# Altium schematic sheet 04_MCU.SchDoc: =TitleParameter
size A3; Organization: ASISGUARD; Address1: Kemalpasa, Kemalpasa Cd. No:290 D:292H, 35060 Bornova/Izmir/Turkey
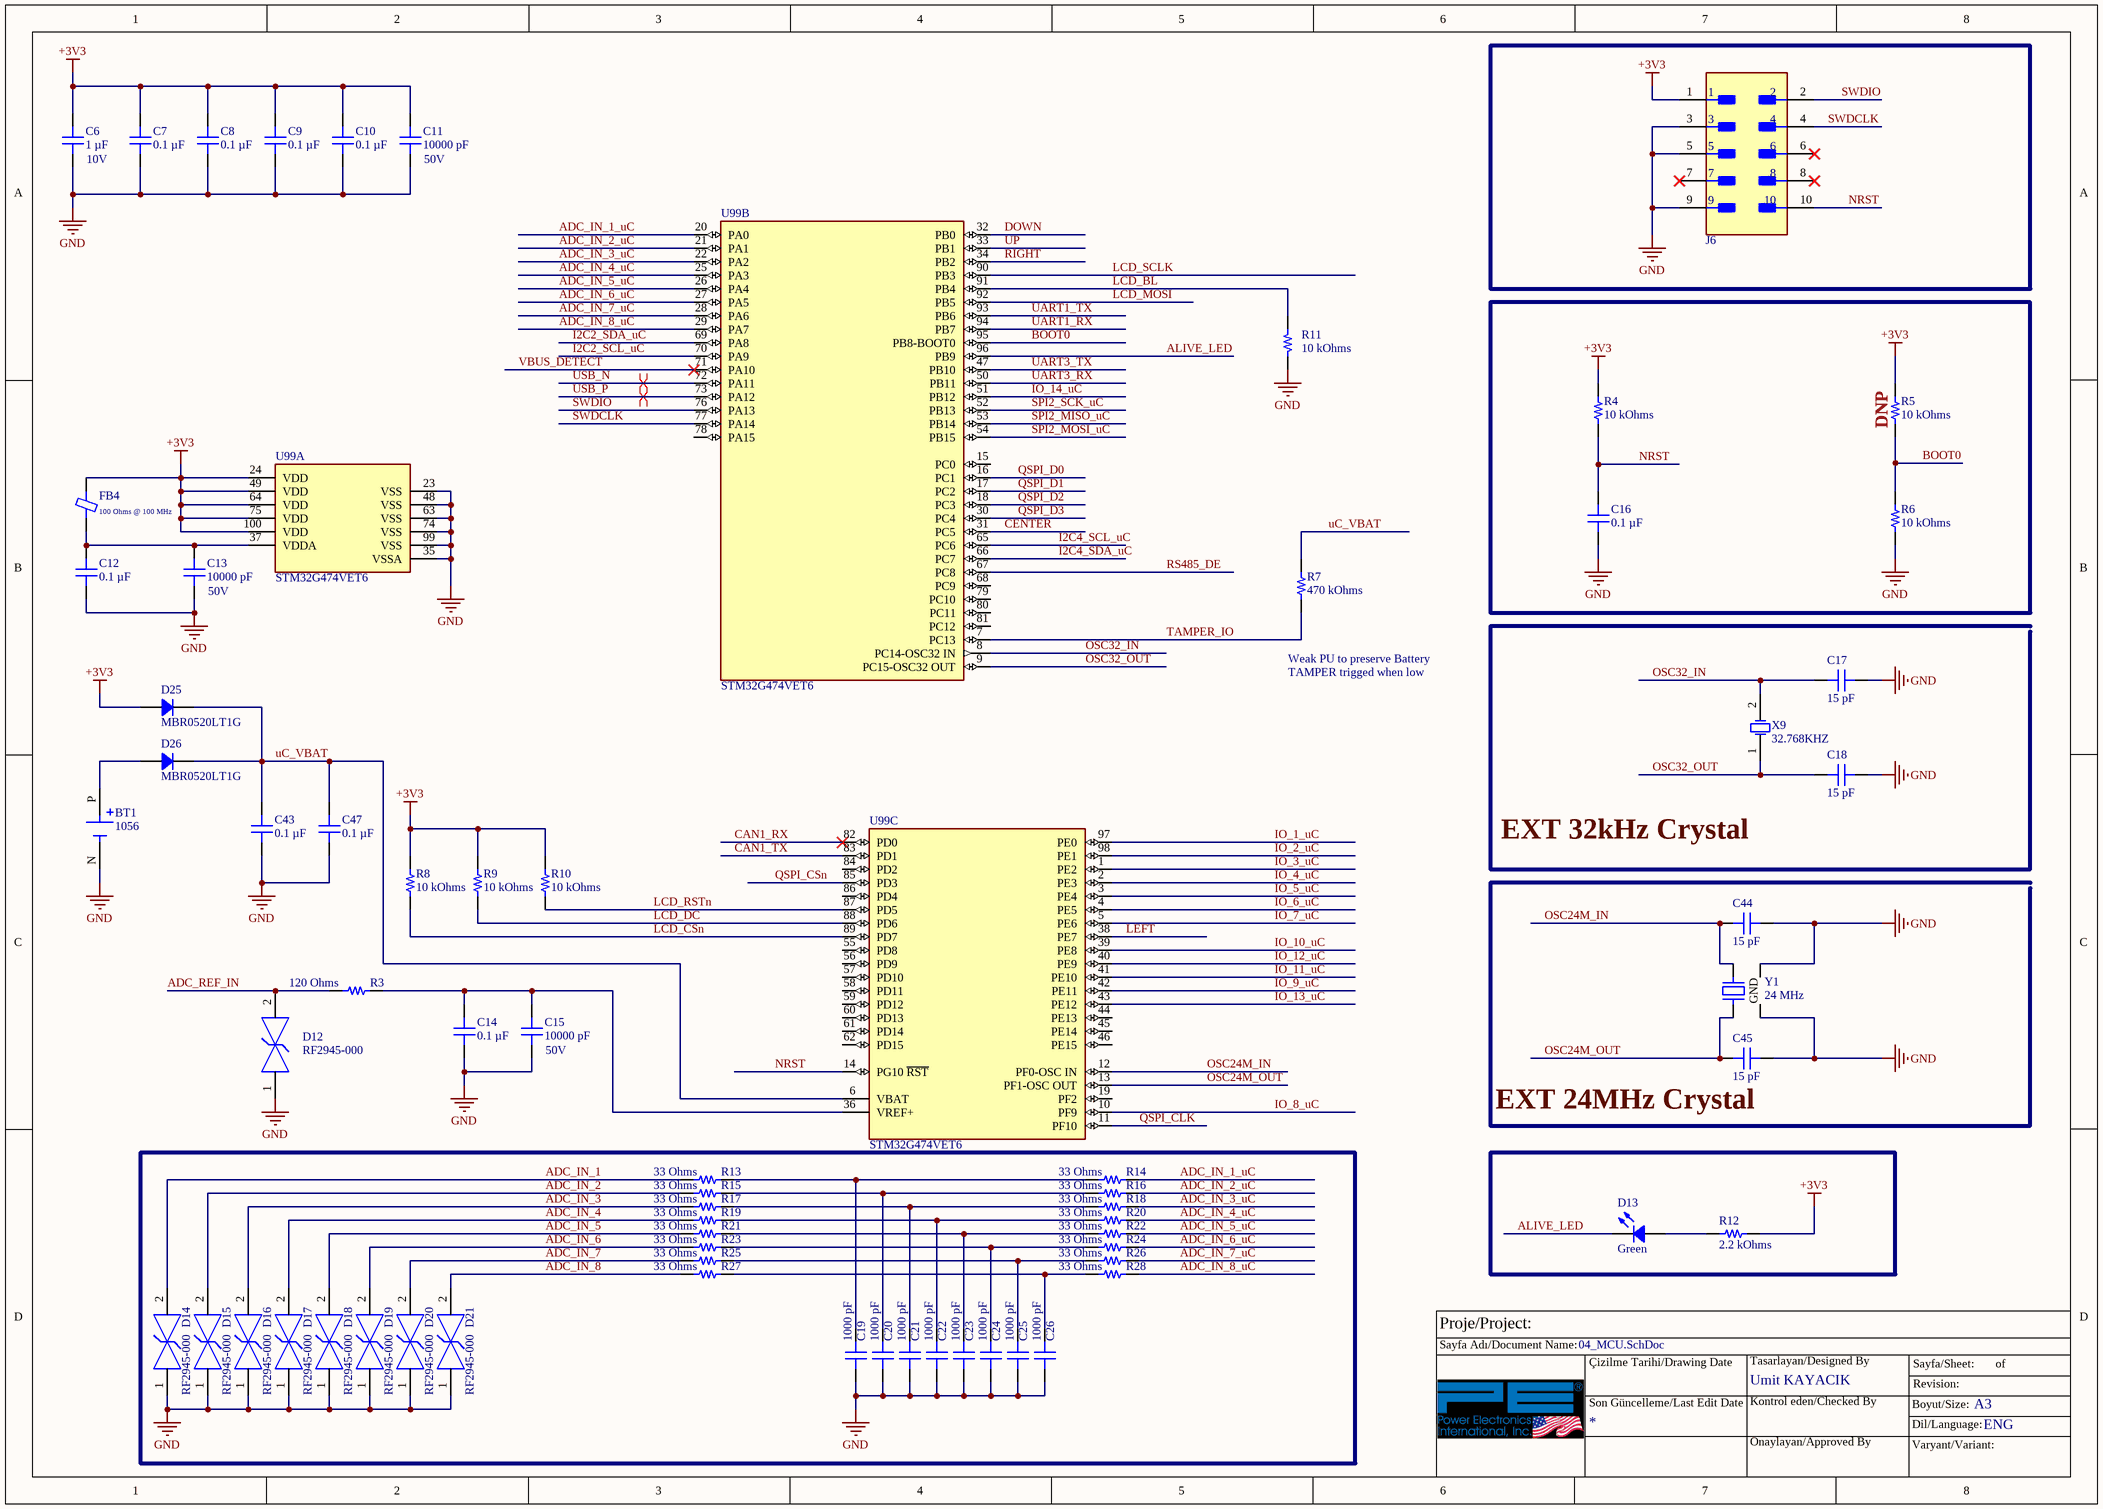
[diagram p0: 04_MCU.SchDoc]

## Parts
BT1  1056  [BAT_1056]
C6  Voltage - Rated: 10V  [CAP 0402_1005]  (hidden comment: 1 µF)
C7  0.1 µF  [MURATA GRM155 0402_1005]
C8  0.1 µF  [MURATA GRM155 0402_1005]
C9  0.1 µF  [MURATA GRM155 0402_1005]
C10  0.1 µF  [MURATA GRM155 0402_1005]
C11  Voltage - Rated: 50V  [CAP 0402_1005]  (hidden comment: 10000 pF)
C12  0.1 µF  [MURATA GRM155 0402_1005]
C13  Voltage - Rated: 50V  [CAP 0402_1005]  (hidden comment: 10000 pF)
C14  0.1 µF  [MURATA GRM155 0402_1005]
C15  Voltage - Rated: 50V  [CAP 0402_1005]  (hidden comment: 10000 pF)
C16  0.1 µF  [MURATA GRM155 0402_1005]
C17  15 pF  [CAP 0402_1005]
C18  15 pF  [CAP 0402_1005]
C19  1000 pF  [CAP 0402_1005]
C20  1000 pF  [CAP 0402_1005]
C21  1000 pF  [CAP 0402_1005]
C22  1000 pF  [CAP 0402_1005]
C23  1000 pF  [CAP 0402_1005]
C24  1000 pF  [CAP 0402_1005]
C25  1000 pF  [CAP 0402_1005]
C26  1000 pF  [CAP 0402_1005]
C43  0.1 µF  [MURATA GRM155 0402_1005]
C44  15 pF  [CAP 0402_1005]
C45  15 pF  [CAP 0402_1005]
C47  0.1 µF  [MURATA GRM155 0402_1005]
D12  RF2945-000  [FP-SESD0402-MFG]
D13  Green  [LED 0603_1608 GREEN]
D14  RF2945-000  [FP-SESD0402-MFG]
D15  RF2945-000  [FP-SESD0402-MFG]
D16  RF2945-000  [FP-SESD0402-MFG]
D17  RF2945-000  [FP-SESD0402-MFG]
D18  RF2945-000  [FP-SESD0402-MFG]
D19  RF2945-000  [FP-SESD0402-MFG]
D20  RF2945-000  [FP-SESD0402-MFG]
D21  RF2945-000  [FP-SESD0402-MFG]
D25  MBR0520LT1G  [SOD-123]
D26  MBR0520LT1G  [SOD-123]
FB4  100 Ohms @ 100 MHz  [FER 0603_1608]
J6  FTSH-105-01-F-DV-K-P-TR  [Samtec_0_MFG]  (value not drawn)
R3  120 Ohms  [YAGEO RES 0805_2012]
R4  10 kOhms  [RES 0402_1005]
R5  10 kOhms  [RES 0402_1005]
R6  10 kOhms  [RES 0402_1005]
R7  470 kOhms  [YAGEO RES 0402_1005]
R8  10 kOhms  [RES 0402_1005]
R9  10 kOhms  [RES 0402_1005]
R10  10 kOhms  [RES 0402_1005]
R11  10 kOhms  [RES 0402_1005]
R12  2.2 kOhms  [RES 0402_1005]
R13  33 Ohms  [YAGEO RES 0402_1005]
R14  33 Ohms  [YAGEO RES 0402_1005]
R15  33 Ohms  [YAGEO RES 0402_1005]
R16  33 Ohms  [YAGEO RES 0402_1005]
R17  33 Ohms  [YAGEO RES 0402_1005]
R18  33 Ohms  [YAGEO RES 0402_1005]
R19  33 Ohms  [YAGEO RES 0402_1005]
R20  33 Ohms  [YAGEO RES 0402_1005]
R21  33 Ohms  [YAGEO RES 0402_1005]
R22  33 Ohms  [YAGEO RES 0402_1005]
R23  33 Ohms  [YAGEO RES 0402_1005]
R24  33 Ohms  [YAGEO RES 0402_1005]
R25  33 Ohms  [YAGEO RES 0402_1005]
R26  33 Ohms  [YAGEO RES 0402_1005]
R27  33 Ohms  [YAGEO RES 0402_1005]
R28  33 Ohms  [YAGEO RES 0402_1005]
U99  STM32G474VET6  [FP-LQFP100-1L-IPC_B]  (parts A,B,C of 3)
X9  value 32.768KHZ  [CRY_ABS07]  (hidden comment: CRYSTAL 32.7680KHZ 12.5PF SMD)
Y1  24 MHz  [EPSON TSX-3225]

## Blocks framed on the sheet
DNP: C16 R4-R6

## Nets
+3V3: C6.2 C7.2 C8.2 C9.2 C10.2 C11.2 D25.1 FB4.2 J6.1 R4.1 R5.1 R8.1 R9.1 R10.1 R12.2 U99.24(VDD) U99.49(VDD) U99.64(VDD) U99.75(VDD) U99.100(VDD)
GND: BT1.N(NEG) C6.1 C7.1 C8.1 C9.1 C10.1 C11.1 C12.1 C13.1 C14.1 C15.1 C16.1 C17.2 C18.2 C19.1 C20.1 C21.1 C22.1 C23.1 C24.1 C25.1 C26.1 C43.1 C44.2 C45.2 C47.1 D12.1 D14.1 D15.1 D16.1 D17.1 D18.1 D19.1 D20.1 D21.1 J6.3 J6.5 J6.9 R6.2 R11.2 U99.23(VSS) U99.35(VSSA) U99.48(VSS) U99.63(VSS) U99.74(VSS) U99.99(VSS) Y1.2(GND) Y1.4(GND)
ADC_IN_1: D14.2 R13.1
ADC_IN_1_uC: R14.2 U99.20(PA0)
ADC_IN_2: D15.2 R15.1
ADC_IN_2_uC: R16.2 U99.21(PA1)
ADC_IN_3: D16.2 R17.1
ADC_IN_3_uC: R18.2 U99.22(PA2)
ADC_IN_4: D17.2 R19.1
ADC_IN_4_uC: R20.2 U99.25(PA3)
ADC_IN_5: D18.2 R21.1
ADC_IN_5_uC: R22.2 U99.26(PA4)
ADC_IN_6: D19.2 R23.1
ADC_IN_6_uC: R24.2 U99.27(PA5)
ADC_IN_7: D20.2 R25.1
ADC_IN_7_uC: R26.2 U99.28(PA6)
ADC_IN_8: D21.2 R27.1
ADC_IN_8_uC: R28.2 U99.29(PA7)
ADC_REF_IN: D12.2 R3.1
ALIVE_LED: D13.2 U99.96(PB9)
BOOT0: R5.2 R6.1 U99.95(PB8-BOOT0)
CAN1_RX: U99.82(PD0)
CAN1_TX: U99.83(PD1)
CENTER: U99.31(PC5)
DOWN: U99.32(PB0)
I2C2_SCL_uC: U99.70(PA9)
I2C2_SDA_uC: U99.69(PA8)
I2C4_SCL_uC: U99.65(PC6)
I2C4_SDA_uC: U99.66(PC7)
IO_1_uC: U99.97(PE0)
IO_2_uC: U99.98(PE1)
IO_3_uC: U99.1(PE2)
IO_4_uC: U99.2(PE3)
IO_5_uC: U99.3(PE4)
IO_6_uC: U99.4(PE5)
IO_7_uC: U99.5(PE6)
IO_8_uC: U99.10(PF9)
IO_9_uC: U99.42(PE11)
IO_10_uC: U99.39(PE8)
IO_11_uC: U99.41(PE10)
IO_12_uC: U99.40(PE9)
IO_13_uC: U99.43(PE12)
IO_14_uC: U99.51(PB12)
LCD_BL: R11.1 U99.91(PB4)
LCD_CSn: R8.2 U99.89(PD7)
LCD_DC: R9.2 U99.88(PD6)
LCD_MOSI: U99.92(PB5)
LCD_RSTn: R10.2 U99.87(PD5)
LCD_SCLK: U99.90(PB3)
LEFT: U99.38(PE7)
NRST: C16.2 J6.10 R4.2 U99.14(PG10_~{RST})
OSC24M_IN: C44.1 U99.12(PF0-OSC_IN) Y1.3
OSC24M_OUT: C45.1 U99.13(PF1-OSC_OUT) Y1.1
OSC32_IN: C17.1 U99.8(PC14-OSC32_IN) X9.2(OSC2)
OSC32_OUT: C18.1 U99.9(PC15-OSC32_OUT) X9.1(OSC1)
QSPI_CLK: U99.11(PF10)
QSPI_CSn: U99.85(PD3)
QSPI_D0: U99.16(PC1)
QSPI_D1: U99.17(PC2)
QSPI_D2: U99.18(PC3)
QSPI_D3: U99.30(PC4)
RIGHT: U99.34(PB2)
RS485_DE: U99.67(PC8)
SPI2_MISO_uC: U99.53(PB14)
SPI2_MOSI_uC: U99.54(PB15)
SPI2_SCK_uC: U99.52(PB13)
SWDCLK: J6.4 U99.77(PA14)
SWDIO: J6.2 U99.76(PA13)
TAMPER_IO: R7.1 U99.7(PC13)
UART1_RX: U99.94(PB7)
UART1_TX: U99.93(PB6)
UART3_RX: U99.50(PB11)
UART3_TX: U99.47(PB10)
uC_VBAT: C43.2 C47.2 D25.2 D26.2 R7.2 U99.6(VBAT)
UP: U99.33(PB1)
USB_N: U99.72(PA11)
USB_P: U99.73(PA12)
VBUS_DETECT: U99.71(PA10)
NetBT1_P: BT1.P(POS) D26.1
NetC12_2: C12.2 C13.2 FB4.1 U99.37(VDDA)
NetC14_2: C14.2 C15.2 R3.2 U99.36(VREF+)
NetC19_2: C19.2 R13.2 R14.1
NetC20_2: C20.2 R15.2 R16.1
NetC21_2: C21.2 R17.2 R18.1
NetC22_2: C22.2 R19.2 R20.1
NetC23_2: C23.2 R21.2 R22.1
NetC24_2: C24.2 R23.2 R24.1
NetC25_2: C25.2 R25.2 R26.1
NetC26_2: C26.2 R27.2 R28.1
NetD13_1: D13.1 R12.1

Not connected (* = marked no-connect by the designer): J6 6* 7* 8*; U99 15(PC0) 19(PF2) 44(PE13) 45(PE14) 46(PE15) 55(PD8) 56(PD9) 57(PD10) 58(PD11) 59(PD12) 60(PD13) 61(PD14) 62(PD15) 68(PC9) 78(PA15) 79(PC10) 80(PC11) 81(PC12) 84(PD2) 86(PD4)

## Layout directives
differential pair: USB_N, USB_P

## Notes on the sheet
- Weak PU to preserve Battery
- TAMPER trigged when low
- EXT 32kHz Crystal
- (near C45) EXT 24MHz Crystal
- Proje/Project:
- Sayfa Adı/Document Name:
- Çizilme Tarihi/Drawing Date
- Umit KAYACIK
- Tasarlayan/Designed By
- Sayfa/Sheet:
- Revision:
- of
- Son Güncelleme/Last Edit Date
- Kontrol eden/Checked By
- Onaylayan/Approved By
- Boyut/Size:
- Varyant/Variant:
- Dil/Language:
- A3
- ENG

## Library data of the parts
BT1 = 1056: Battery Holder, SMT, 1 Coin Cell, 12mm, Plastic, UL94V-0 | Keystone Electronics 1056; MF: Keystone Electronics Corp.; SnapEDA_Link: https://www.snapeda.com/parts/1056/Keystone/view-part/?ref=snap; Package: None; Value: *; MP: 1056; Check_prices: https://www.snapeda.com/parts/1056/Keystone/view-part/?ref=eda
C6 = C1005X7S1A105K050BC: CAP CER 1UF 10V X7S 0402; manufacturer: TDK Corporation; Tolerance: ±10%; Part Number: C1005X7S1A105K050BC; Value: 1 µF; Applications: General Purpose; Capacitance: 1 µF; componentlink1description: Datasheet; componentlink1url: https://product.tdk.com/info/en/catalog/datasheets/mlcc_commercial_general_en.pdf?ref_disty=digikey; componentlink2description: DigiKey Link; componentlink2url: https://www.digikey.com/en/products/detail/tdk-corporation/C1005X7S1A105K050BC/3661576; Device Package: 0402 (1005 Metric); Features: Low ESL; lastupdated: 2/9/2024 8:04:17 PM; Lifecycle Status: Active; Minimum Order: 1; Mounting Type: Surface Mount, MLCC; Operating Temperature: -55°C ~ 125°C; Package / Case: 0402 (1005 Metric); packaging: TapeAndReel; partid: 34315; Part Status: Active; price: 0.03; series: C; Size / Dimension: 0.039" L x 0.020" W (1.00mm x 0.50mm); Supplier 1: DigiKey; Supplier Part Number 1: 445-9116-1-ND; Temperature Coefficient: X7S; Thickness (Max): 0.022" (0.55mm)
C7-C10 C12 C14 C16 C43 C47 = GRM155R71H104KE14J: CAP CER 0.1UF 50V X7R 0402; manufacturer: Murata Electronics; Tolerance: ±10%; Part Number: GRM155R71H104KE14J; Capacitance: 0.1 µF; Applications: General Purpose; componentlink1description: Datasheet; componentlink1url: https://search.murata.co.jp/Ceramy/image/img/A01X/G101/ENG/GRM155R71H104KE14-01.pdf; componentlink2description: DigiKey Link; componentlink2url: https://www.digikey.com/en/products/detail/murata-electronics/GRM155R71H104KE14J/4905180; Device Package: 0402 (1005 Metric); lastupdated: 7/23/2025 10:42:35 AM; Lifecycle Status: Active; Minimum Order: 1; Mounting Type: Surface Mount, MLCC; Operating Temperature: -55°C ~ 125°C; Package / Case: 0402 (1005 Metric); packaging: CutTape; partid: 4071; Part Status: Active; price: 0.01; series: GRM; Size / Dimension: 0.039" L x 0.020" W (1.00mm x 0.50mm); Supplier 1: DigiKey; Supplier Part Number 1: 490-13342-1-ND; Temperature Coefficient: X7R; Thickness (Max): 0.022" (0.55mm); value: 0.1 µF; Voltage - Rated: 50V
C11 C13 C15 = CC0402KRX7R9BB103: CAP CER 10000PF 50V X7R 0402; manufacturer: Yageo; Tolerance: ±10%; Part Number: CC0402KRX7R9BB103; Value: 10000 pF; Applications: General Purpose; Capacitance: 10000 pF; componentlink1description: Datasheet; componentlink1url: https://www.yageo.com/upload/media/product/productsearch/datasheet/mlcc/UPY-GPHC_X7R_6.3V-to-50V_18.pdf; componentlink2description: DigiKey Link; componentlink2url: https://www.digikey.com/en/products/detail/yageo/CC0402KRX7R9BB103/2103087; Device Package: 0402 (1005 Metric); lastupdated: 2/9/2024 8:04:30 PM; Lifecycle Status: Active; Minimum Order: 10; Mounting Type: Surface Mount, MLCC; Operating Temperature: -55°C ~ 125°C; Package / Case: 0402 (1005 Metric); packaging: CutTape; partid: 6681; Part Status: Active; price: 0.01; series: CC; Size / Dimension: 0.039" L x 0.020" W (1.00mm x 0.50mm); Supplier 1: DigiKey; Supplier Part Number 1: 311-1349-1-ND; Temperature Coefficient: X7R; Thickness (Max): 0.022" (0.55mm)
C17 C18 C44 C45 = CC0402GRNPO9BN150: CAP CER 15PF 50V C0G/NPO 0402; manufacturer: Yageo; Temperature Coefficient: C0G, NP0; Tolerance: ±2%; Part Number: CC0402GRNPO9BN150; Value: 15 pF; Applications: General Purpose; Capacitance: 15 pF; componentlink1description: Datasheet; componentlink1url: https://www.yageo.com/upload/media/product/productsearch/datasheet/mlcc/UPY-GP_NP0_16V-to-50V_17.pdf; componentlink2description: DigiKey Link; componentlink2url: https://www.digikey.com/en/products/detail/yageo/CC0402GRNPO9BN150/5195058; Device Package: 0402 (1005 Metric); lastupdated: 2/9/2024 8:04:37 PM; Lifecycle Status: Active; Minimum Order: 10; Mounting Type: Surface Mount, MLCC; Operating Temperature: -55°C ~ 125°C; Package / Case: 0402 (1005 Metric); packaging: TapeAndReel; partid: 1901; Part Status: Active; price: 0.01; series: CC; Size / Dimension: 0.039" L x 0.020" W (1.00mm x 0.50mm); Supplier 1: DigiKey; Supplier Part Number 1: 311-1649-1-ND; Thickness (Max): 0.022" (0.55mm); Voltage - Rated: 50V
C19-C26 = CC0402KRX7R9BB102: CAP CER 1000PF 50V X7R 0402; manufacturer: Yageo; Tolerance: ±10%; Part Number: CC0402KRX7R9BB102; Value: 1000 pF; Applications: General Purpose; Capacitance: 1000 pF; componentlink1description: Datasheet; componentlink1url: https://www.yageo.com/upload/media/product/productsearch/datasheet/mlcc/UPY-GPHC_X7R_6.3V-to-50V_18.pdf; componentlink2description: DigiKey Link; componentlink2url: https://www.digikey.com/en/products/detail/yageo/CC0402KRX7R9BB102/302770; Device Package: 0402 (1005 Metric); lastupdated: 2/9/2024 8:04:33 PM; Lifecycle Status: Active; Minimum Order: 10; Mounting Type: Surface Mount, MLCC; Operating Temperature: -55°C ~ 125°C; Package / Case: 0402 (1005 Metric); packaging: CutTape; partid: 4791; Part Status: Active; price: 0.01; series: CC; Size / Dimension: 0.039" L x 0.020" W (1.00mm x 0.50mm); Supplier 1: DigiKey; Supplier Part Number 1: 311-1036-1-ND; Temperature Coefficient: X7R; Thickness (Max): 0.022" (0.55mm); Voltage - Rated: 50V
D12 D14-D21 = CMP-08607-000062-1: TVS DIODE 7V 10V 0402; Manufacturer: Littelfuse; Value: 0.1pF; Breakdown Voltage: 9.8V; Number Of Channels: 1; Peak Pulse Current: 2A; Direction: Bidirectional; Automotive Grade: Grade 1; Standoff Height: 0mm; Octopart: https://octopart.com/rf2945-000-littelfuse-56516902; Device Class L3: unset; ComponentLink2Description: Datasheet; Lead Free: Yes; Temperature Range Low: -55°C; Clamping Voltage: 10V; Digikey Description: TVS DIODE 7V 10V 0402; Category: Diode; Temperature: -55°C to +125°C; Device Class L1: Circuit Protection; Capacitance: 0.1pF; RoHS: TRUE; Device Class L2: TVS Diodes; Package: SESD0402; Reverse Standoff Voltage: 7V; Automotive: Yes; Height: 0.43mm; Manufacturer Part Number: RF2945-000; Temperature Range High: +125°C; ComponentLink2URL: https://www.littelfuse.com/~/media/electronics/datasheets/tvs_diode_arrays/littelfuse_tvs_diode_array_sesd_ultra_low_capacitance_discrete_tvs_datasheet.pdf.pdf
D13 = TLMP1100-GS08: LED GREEN 0603 SMD; Manufacturer: Vishay Semiconductor Opto Division; Configuration: Standard; Current - Test: 20mA; Lens Color: 0.65mm; Lens Size: 1.60mm x 0.80mm; Lens Style: Rectangle with Flat Top; Millicandela Rating: 15mcd; Viewing Angle: 160°; Voltage - Forward (Vf) (Typ): 2.1V; Wavelength - Dominant: 561nm; Wavelength - Peak: 562nm; Part Number: TLMP1100-GS08; Color: Green; ComponentLink1Description: Datasheet; ComponentLink1URL: http://www.vishay.com/docs/83173/tlmb1100.pdf; ComponentLink2Description: DigiKey Link; ComponentLink2URL: https://www.digikey.com/en/products/detail/vishay-semiconductor-opto-division/TLMP1100-GS08/1681311; Device Package: 0603 (1608 Metric); Height (Max): 0.65mm; LastUpdated: 3/11/2024 7:51:09 AM; Lifecycle Status: Active; Minimum Order: 1; Mounting Type: Surface Mount; Package / Case: 0603 (1608 Metric); Packaging: TapeAndReel; PartId: 692; Part Status: Active; Price: 0.11; Series: Automotive, AEC-Q101; Size / Dimension: 1.60mm L x 0.80mm W; Supplier 1: DigiKey; Supplier Part Number 1: 751-1176-1-ND; Supplier Device Package: 0603; Value: Green
D25 D26 = MBR0520LT1G: DIODE SCHOTTKY 20V 500MA SOD123; Manufacturer: ON Semiconductor; Current - Reverse Leakage @ Vr: 250µA @ 20V; Speed: Fast Recovery =< 500ns, > 200mA (Io); Voltage - Forward (Vf) (Max) @ If: 385mV @ 500mA; Part Number: MBR0520LT1G; ComponentLink1Description: Datasheet; ComponentLink1URL: http://www.onsemi.com/pub/Collateral/MBR0520LT1-D.PDF; ComponentLink2Description: DigiKey Link; ComponentLink2URL: http://digikey.com/product-detail/en/on-semiconductor/MBR0520LT1G/MBR0520LT1GOSCT-ND/917965; Current - Average Rectified (Io): 500mA; Diode Type: Schottky; LastUpdated: 6/3/2024 7:54:46 PM; Lifecycle Status: Active; Minimum Order: 1; Mounting Type: Surface Mount; Operating Temperature - Junction: -65°C ~ 125°C; Package / Case: SOD-123; Packaging: TapeAndReel; PartId: 2222; Part Status: Active; Price: 0.05; Series: -; Supplier 1: DigiKey; Supplier Part Number 1: MBR0520LT1GOSCT-ND; Supplier Device Package: SOD-123; Voltage - DC Reverse (Vr) (Max): 20V
FB4 = MH1608-101Y: FERRITE BEAD 100 OHM 0603 1LN; Manufacturer: Bourns Inc.; Current Rating (Max): 3A; DC Resistance (DCR) (Max): 40mOhm; Filter Type: Power, Signal Line; Number of Lines: 1; Part Number: MH1608-101Y; ComponentLink1Description: Datasheet; ComponentLink1URL: https://www.bourns.com/docs/Product-Datasheets/mh.pdf; ComponentLink2Description: DigiKey Link; ComponentLink2URL: https://www.digikey.com/en/products/detail/bourns-inc/MH1608-101Y/2563310; Device Package: 0603 (1608 Metric); Height (Max): 0.039" (1.00mm); Impedance @ Frequency: 100 Ohms @ 100 MHz; LastUpdated: 5/9/2023 8:13:07 PM; Lifecycle Status: Active; Minimum Order: 1; Mounting Type: Surface Mount; Operating Temperature: -55°C ~ 125°C; Package / Case: 0603 (1608 Metric); Packaging: TapeAndReel; PartId: 645; Part Status: Active; Price: 0.02; Series: MH; Size / Dimension: 0.063" L x 0.032" W (1.60mm x 0.80mm); Supplier 1: DigiKey; Supplier Part Number 1: MH1608-101YCT-ND; Value: 100 Ohms @ 100 MHz
J6 = FTSH-105-01-F-DV-K-P-TR: Connector Header Surface Mount 10 position 0.050" (1.27mm); Manufacturer Name: Samtec Inc.; Pitch - Mating: 0.050(1.27mm); Number of Positions: 10; Manufacturer Part Number: FTSH-105-01-F-DV-K-P-TR; Number of Rows: 2
R3 = RC0805FR-07120RL: RES 120 OHM 1% 1/8W 0805; Manufacturer: Yageo; Power (Watts): 0.125W, 1/8W; Temperature Coefficient: ±100ppm/°C; Part Number: RC0805FR-07120RL; Value: 120 Ohms; ComponentLink1Description: Datasheet; ComponentLink1URL: https://www.yageo.com/upload/media/product/productsearch/datasheet/rchip/PYu-RC_Group_51_RoHS_L_10.pdf; ComponentLink2Description: DigiKey Link; ComponentLink2URL: https://www.digikey.com/en/products/detail/yageo/RC0805FR-07120RL/727575; Composition: Thick Film; Device Package: 0805 (2012 Metric); Features: Moisture Resistant; Height - Seated (Max): 0.024" (0.60mm); LastUpdated: 7/25/2024 9:20:22 AM; Lifecycle Status: Active; Minimum Order: 1; Number of Terminations: 2; Operating Temperature: -55°C ~ 155°C; Package / Case: 0805 (2012 Metric); Packaging: TapeAndReel; PartId: 39440; Part Status: Active; Price: 0.01; Resistance: 120 Ohms; Series: RC_L; Size / Dimension: 0.079" L x 0.049" W (2.00mm x 1.25mm); Supplier 1: DigiKey; Supplier Part Number 1: 311-120CRCT-ND; Supplier Device Package: 0805; Tolerance: ±1%
R4-R6 R8-R11 = RC0402FR-0710KL: RES 10K OHM 1% 1/16W 0402; Manufacturer: Yageo; Power (Watts): 0.063W, 1/16W; Temperature Coefficient: ±100ppm/°C; Part Number: RC0402FR-0710KL; Value: 10 kOhms; ComponentLink1Description: Datasheet; ComponentLink1URL: https://www.yageo.com/upload/media/product/productsearch/datasheet/rchip/PYu-RC_Group_51_RoHS_L_10.pdf; ComponentLink2Description: DigiKey Link; ComponentLink2URL: https://www.digikey.com/en/products/detail/yageo/RC0402FR-0710KL/726523; Composition: Thick Film; Device Package: 0402 (1005 Metric); Features: Moisture Resistant; Height - Seated (Max): 0.016" (0.40mm); LastUpdated: 30.04.2023 19:24:29; Lifecycle Status: Active; Minimum Order: 1; Number of Terminations: 2; Operating Temperature: -55°C ~ 155°C; Package / Case: 0402 (1005 Metric); Packaging: CutTape; PartId: 17593; Part Status: Active; Price: 0.01; Resistance: 10 kOhms; Series: RC_L; Size / Dimension: 0.039" L x 0.020" W (1.00mm x 0.50mm); Supplier 1: DigiKey; Supplier Part Number 1: 311-10.0KLRCT-ND; Supplier Device Package: 0402; Tolerance: ±1%
R7 = RC0402FR-07470KL: RES 470K OHM 1% 1/16W 0402; Manufacturer: Yageo; Power (Watts): 0.063W, 1/16W; Temperature Coefficient: ±100ppm/°C; Part Number: RC0402FR-07470KL; Value: 470 kOhms; ComponentLink1Description: Datasheet; ComponentLink1URL: https://www.yageo.com/upload/media/product/productsearch/datasheet/rchip/PYu-RC_Group_51_RoHS_L_10.pdf; ComponentLink2Description: DigiKey Link; ComponentLink2URL: https://www.digikey.com/en/products/detail/yageo/RC0402FR-07470KL/726618; Composition: Thick Film; Device Package: 0402 (1005 Metric); Features: Moisture Resistant; Height - Seated (Max): 0.016" (0.40mm); LastUpdated: 8/31/2025 3:04:04 PM; Lifecycle Status: Active; Minimum Order: 1; Number of Terminations: 2; Operating Temperature: -55°C ~ 155°C; Package / Case: 0402 (1005 Metric); Packaging: CutTape; PartId: 17965; Part Status: Active; Price: 0.01; Resistance: 470 kOhms; Series: RC_L; Size / Dimension: 0.039" L x 0.020" W (1.00mm x 0.50mm); Supplier 1: DigiKey; Supplier Part Number 1: 311-470KLRCT-ND; Supplier Device Package: 0402; Tolerance: ±1%
R12 = RMCF0402FT2K20: RES 2.2K OHM 1% 1/16W 0402; Manufacturer: Stackpole Electronics Inc; Power (Watts): 0.063W, 1/16W; Temperature Coefficient: ±100ppm/°C; Part Number: RMCF0402FT2K20; Value: 2.2 kOhms; ComponentLink1Description: Datasheet; ComponentLink1URL: https://www.seielect.com/catalog/sei-rmcf_rmcp.pdf; ComponentLink2Description: DigiKey Link; ComponentLink2URL: https://www.digikey.com/en/products/detail/stackpole-electronics-inc/RMCF0402FT2K20/2417439; Composition: Thick Film; Device Package: 0402 (1005 Metric); Features: Automotive AEC-Q200; Height - Seated (Max): 0.016" (0.40mm); LastUpdated: 2/9/2024 8:30:13 PM; Lifecycle Status: Active; Minimum Order: 1; Number of Terminations: 2; Operating Temperature: -55°C ~ 155°C; Package / Case: 0402 (1005 Metric); Packaging: CutTape; PartId: 4919; Part Status: Active; Price: 0.01; Ratings: AEC-Q200; Resistance: 2.2 kOhms; Series: RMCF; Size / Dimension: 0.039" L x 0.020" W (1.00mm x 0.50mm); Supplier 1: DigiKey; Supplier Part Number 1: RMCF0402FT2K20CT-ND; Supplier Device Package: 0402; Tolerance: ±1%
R13-R28 = RC0402FR-0733RL: RES 33 OHM 1% 1/16W 0402; Manufacturer: Yageo; Power (Watts): 0.063W, 1/16W; Temperature Coefficient: ±100ppm/°C; Part Number: RC0402FR-0733RL; Value: 33 Ohms; ComponentLink1Description: Datasheet; ComponentLink1URL: https://www.yageo.com/upload/media/product/productsearch/datasheet/rchip/PYu-RC_Group_51_RoHS_L_10.pdf; ComponentLink2Description: DigiKey Link; ComponentLink2URL: https://www.digikey.com/en/products/detail/yageo/RC0402FR-0733RL/726593; Composition: Thick Film; Device Package: 0402 (1005 Metric); Features: Moisture Resistant; Height - Seated (Max): 0.016" (0.40mm); LastUpdated: 8/31/2025 3:03:59 PM; Lifecycle Status: Active; Minimum Order: 1; Number of Terminations: 2; Operating Temperature: -55°C ~ 155°C; Package / Case: 0402 (1005 Metric); Packaging: CutTape; PartId: 20555; Part Status: Active; Price: 0.01; Resistance: 33 Ohms; Series: RC_L; Size / Dimension: 0.039" L x 0.020" W (1.00mm x 0.50mm); Supplier 1: DigiKey; Supplier Part Number 1: 311-33.0LRCT-ND; Supplier Device Package: 0402; Tolerance: ±1%
U99 = CMP-12105-000116-1: IC MCU 32BIT 512KB FLASH 100LQFP; RoHS Compliant: Yes
X9 = CRY_32.768KHZ: 32.768 kHz ±20ppm Crystal 12.5pF 70 kOhms 2-SMD, No Lead; Manufacturer Part Number: CM7V-T1A-32.768KHZ-12.5PF-20PPM-TB-QA; Order Code: DIGI : 2195-CM7V-T1A-32.768KHZ-12.5PF-20PPM-TB-QACT-ND
Y1 = TSX-3225 24.0000MF20G-AC3: CRYSTAL 24.0000MHZ 9PF SMD; Manufacturer: EPSON; ESR (Equivalent Series Resistance): 40 Ohms; Frequency Stability: ±20ppm; Frequency Tolerance: ±10ppm; Operating Mode: Fundamental; Part Number: TSX-3225 24.0000MF20G-AC3; ComponentLink1Description: Datasheet; ComponentLink1URL: https://support.epson.biz/td/api/doc_check.php?dl=brief_TSX-3225&lang=en; ComponentLink2Description: DigiKey Link; ComponentLink2URL: https://www.digikey.com/en/products/detail/epson/TSX-3225-24-0000MF20G-AC3/1825443; Frequency: 24 MHz; Height - Seated (Max): 0.024" (0.60mm); LastUpdated: 6/3/2024 8:02:15 PM; Lifecycle Status: Active; Load Capacitance: 9pF; Minimum Order: 1; Mounting Type: Surface Mount; Operating Temperature: -40°C ~ 105°C; Package / Case: 4-SMD, No Lead; Packaging: TapeAndReel; PartId: 440; Part Status: Active; Price: 0.40; Series: TSX-3225; Size / Dimension: 0.126" L x 0.098" W (3.20mm x 2.50mm); Supplier 1: DigiKey; Supplier Part Number 1: SER3634CT-ND; Type: MHz Crystal; Value: 24 MHz